# Altium schematic sheet Battery Connection.SchDoc
size A
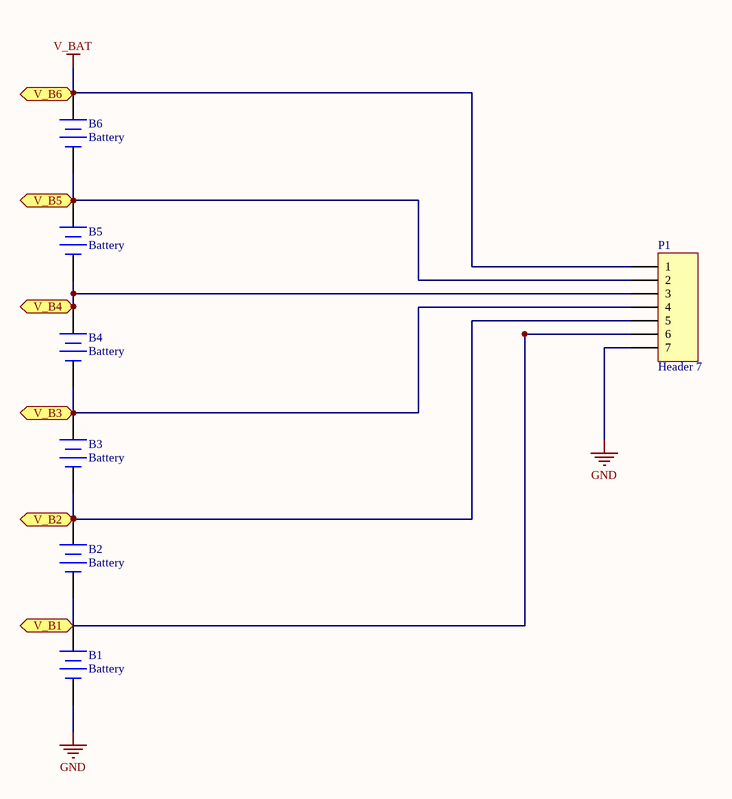
[diagram p0: Battery Connection.SchDoc]

## Parts
B1  Battery  [BAT-2]
B2  Battery  [BAT-2]
B3  Battery  [BAT-2]
B4  Battery  [BAT-2]
B5  Battery  [BAT-2]
B6  Battery  [BAT-2]
P1  Header 7  [HDR1X7]

## Ports
V_B1, V_B2, V_B3, V_B4, V_B5, V_B6

## Nets
GND: B1.2(-) P1.7
V_BAT: B6.1(+) P1.1
V_B1: P1.6 ; port V_B1
V_B2: B2.1(+) B3.2(-) P1.5 ; port V_B2
V_B3: B3.1(+) B4.2(-) P1.4 ; port V_B3
V_B4: B4.1(+) B5.2(-) P1.3 ; port V_B4
V_B5: B5.1(+) B6.2(-) P1.2 ; port V_B5
NetB1_1: B1.1(+) B2.2(-)

## Library data of the parts
B1-B6 = Battery: Multicell Battery; Published: 24-Mar-1999; LatestRevisionDate: 17-Jul-2002; LatestRevisionNote: Re-released for DXP Platform.; PackageReference: BAT-2; Publisher: Altium Limited; PackageDescription: Battery; 2 Leads
P1 = Header 7: Header, 7-Pin; LatestRevisionDate: 17-Jul-2002; LatestRevisionNote: Re-released for DXP Platform.; Publisher: Altium Limited